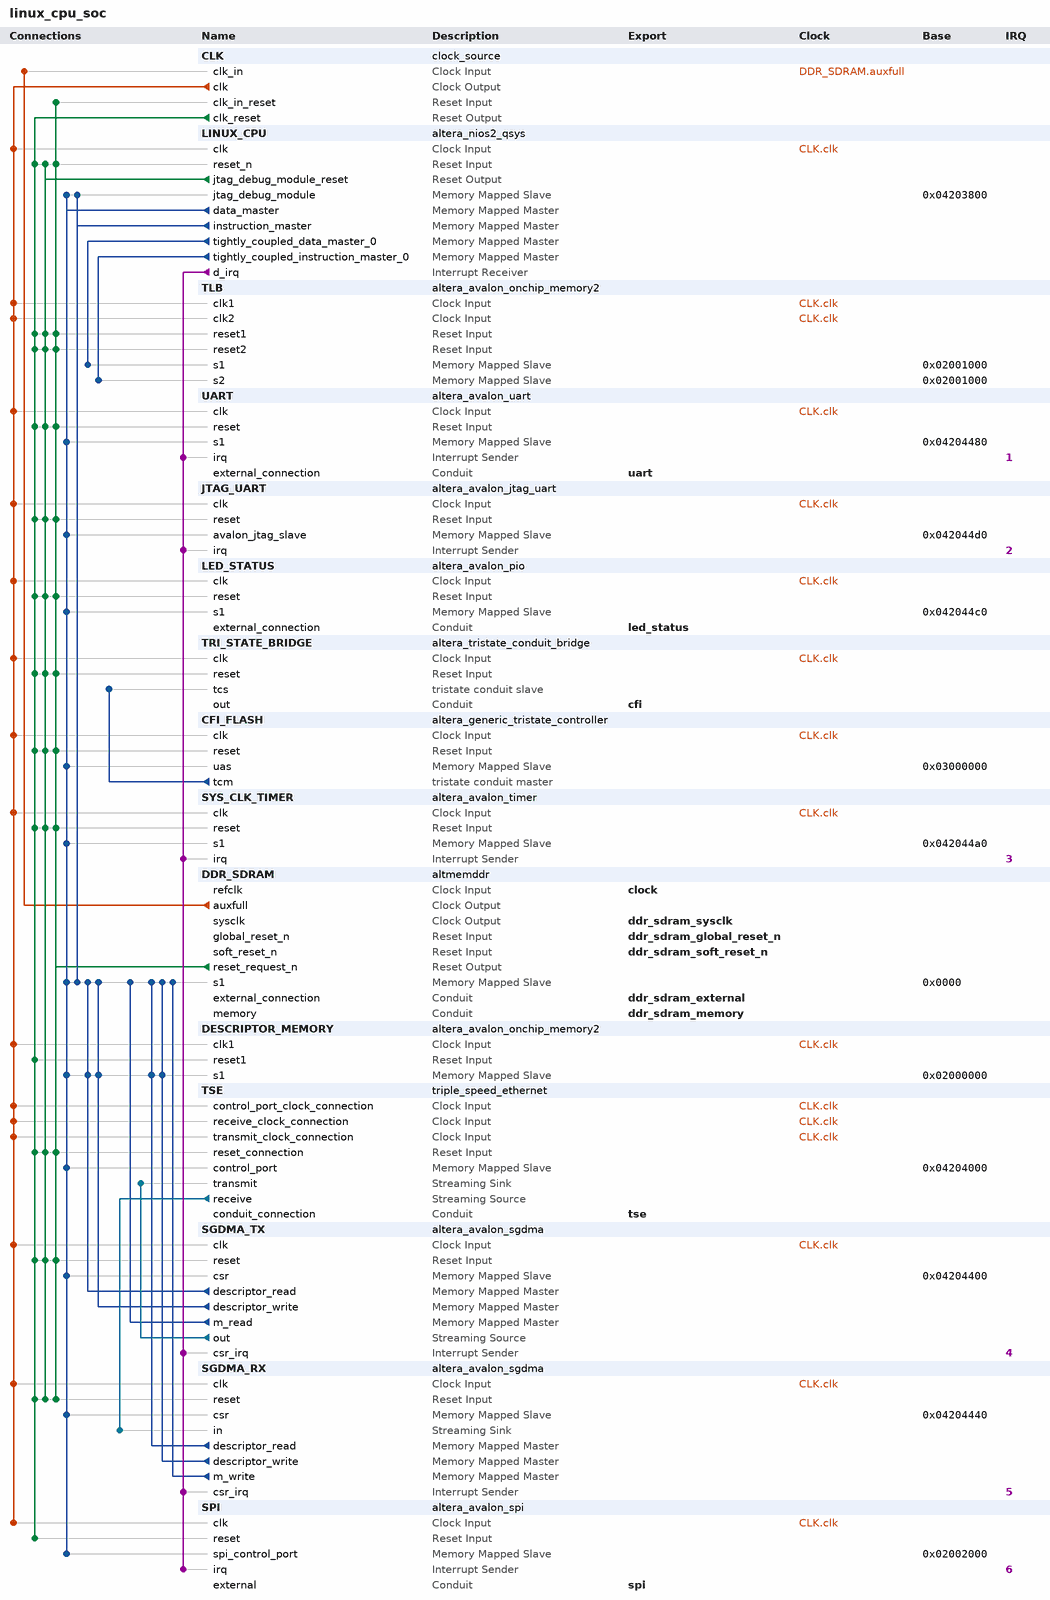
[diagram p0: system contents]
# Platform Designer (Qsys) system linux_cpu_soc, Cyclone III EP3C25F324C6
# Parameters at their usual value, and those the tool derives, are not listed.
package require -exact qsys 12.0
create_system linux_cpu_soc
set_project_property DEVICE_FAMILY {Cyclone III}
set_project_property DEVICE EP3C25F324C6

add_instance CLK clock_source 12.0
set_instance_parameter_value CLK clockFrequency 100000000

add_instance LINUX_CPU altera_nios2_qsys 12.0
set_instance_parameter_value LINUX_CPU mmu_enabled true
set_instance_parameter_value LINUX_CPU resetSlave DDR_SDRAM.s1
set_instance_parameter_value LINUX_CPU mmu_TLBMissExcSlave TLB.s2
set_instance_parameter_value LINUX_CPU exceptionSlave DDR_SDRAM.s1
set_instance_parameter_value LINUX_CPU breakSlave LINUX_CPU.jtag_debug_module
set_instance_parameter_value LINUX_CPU impl Fast
set_instance_parameter_value LINUX_CPU icache_size 4096
set_instance_parameter_value LINUX_CPU icache_numTCIM 1
set_instance_parameter_value LINUX_CPU dcache_numTCDM 1

add_instance TLB altera_avalon_onchip_memory2 12.0
set_instance_parameter_value TLB dataWidth 32
set_instance_parameter_value TLB dualPort true
set_instance_parameter_value TLB initMemContent true
set_instance_parameter_value TLB initializationFileName TLB
set_instance_parameter_value TLB memorySize 4096

add_instance UART altera_avalon_uart 12.0
set_instance_parameter_value UART baud 9600
set_instance_parameter_value UART dataBits 8
set_instance_parameter_value UART fixedBaud false
set_instance_parameter_value UART parity NONE
set_instance_parameter_value UART stopBits 1

add_instance JTAG_UART altera_avalon_jtag_uart 12.0
set_instance_parameter_value JTAG_UART simInteractiveOptions INTERACTIVE_ASCII_OUTPUT

add_instance LED_STATUS altera_avalon_pio 12.0
set_instance_parameter_value LED_STATUS direction Output
set_instance_parameter_value LED_STATUS resetValue 3
set_instance_parameter_value LED_STATUS width 2

add_instance TRI_STATE_BRIDGE altera_tristate_conduit_bridge 12.0

add_instance CFI_FLASH altera_generic_tristate_controller 12.0
set_instance_parameter_value CFI_FLASH TCM_ADDRESS_W 24
set_instance_parameter_value CFI_FLASH TCM_DATA_W 16
set_instance_parameter_value CFI_FLASH TCM_BYTEENABLE_W 2
set_instance_parameter_value CFI_FLASH TCM_READ_WAIT 100
set_instance_parameter_value CFI_FLASH TCM_WRITE_WAIT 100
set_instance_parameter_value CFI_FLASH TCM_SETUP_WAIT 25
set_instance_parameter_value CFI_FLASH TCM_DATA_HOLD 20
set_instance_parameter_value CFI_FLASH TCM_MAX_PENDING_READ_TRANSACTIONS 3
set_instance_parameter_value CFI_FLASH TCM_TURNAROUND_TIME 2
set_instance_parameter_value CFI_FLASH TCM_TIMING_UNITS 0
set_instance_parameter_value CFI_FLASH TCM_READLATENCY 2
set_instance_parameter_value CFI_FLASH TCM_SYMBOLS_PER_WORD 2
set_instance_parameter_value CFI_FLASH USE_READ 1
set_instance_parameter_value CFI_FLASH USE_BEGINTRANSFER 0
set_instance_parameter_value CFI_FLASH USE_BYTEENABLE 0
set_instance_parameter_value CFI_FLASH USE_OUTPUTENABLE 0
set_instance_parameter_value CFI_FLASH ACTIVE_LOW_READ 1
set_instance_parameter_value CFI_FLASH ACTIVE_LOW_BYTEENABLE 0
set_instance_parameter_value CFI_FLASH ACTIVE_LOW_OUTPUTENABLE 0
set_instance_parameter_value CFI_FLASH ACTIVE_LOW_BEGINTRANSFER 0
set_instance_parameter_value CFI_FLASH CHIPSELECT_THROUGH_READLATENCY 0
set_instance_parameter_value CFI_FLASH MODULE_ASSIGNMENT_KEYS embeddedsw.configuration.hwClassnameDriverSupportList,embeddedsw.configuration.hwClassnameDriverSupportDefault,embeddedsw.CMacro.SETUP_VALUE,embeddedsw.CMacro.WAIT_VALUE,embeddedsw.CMacro.HOLD_VALUE,embeddedsw.CMacro.TIMING_UNITS,embeddedsw.CMacro.SIZE,embeddedsw.memoryInfo.MEM_INIT_DATA_WIDTH,embeddedsw.memoryInfo.HAS_BYTE_LANE,embeddedsw.memoryInfo.IS_FLASH,embeddedsw.memoryInfo.GENERATE_DAT_SYM,embeddedsw.memoryInfo.GENERATE_FLASH,embeddedsw.memoryInfo.DAT_SYM_INSTALL_DIR,embeddedsw.memoryInfo.FLASH_INSTALL_DIR
set_instance_parameter_value CFI_FLASH MODULE_ASSIGNMENT_VALUES {altera_avalon_lan91c111:altera_avalon_cfi_flash,altera_avalon_cfi_flash,25,100,20,"ns",16777216u,16,1,1,1,1,SIM_DIR,APP_DIR}
set_instance_parameter_value CFI_FLASH INTERFACE_ASSIGNMENT_KEYS embeddedsw.configuration.isFlash,embeddedsw.configuration.isMemoryDevice,embeddedsw.configuration.isNonVolatileStorage
set_instance_parameter_value CFI_FLASH INTERFACE_ASSIGNMENT_VALUES 1,1,1

add_instance SYS_CLK_TIMER altera_avalon_timer 12.0
set_instance_parameter_value SYS_CLK_TIMER period 1
set_instance_parameter_value SYS_CLK_TIMER periodUnits MSEC
set_instance_parameter_value SYS_CLK_TIMER timerPreset FULL_FEATURED

add_instance DDR_SDRAM altmemddr 12.0
set_instance_parameter_value DDR_SDRAM pipeline_commands false
set_instance_parameter_value DDR_SDRAM debug_en false
set_instance_parameter_value DDR_SDRAM export_debug_port false
set_instance_parameter_value DDR_SDRAM use_generated_memory_model true
set_instance_parameter_value DDR_SDRAM dedicated_memory_clk_phase_label {Dedicated memory clock phase:}
set_instance_parameter_value DDR_SDRAM mem_if_clk_mhz 100.0
set_instance_parameter_value DDR_SDRAM quartus_project_exists false
set_instance_parameter_value DDR_SDRAM local_if_drate Full
set_instance_parameter_value DDR_SDRAM enable_v72_rsu false
set_instance_parameter_value DDR_SDRAM local_if_clk_mhz_label 100,0
set_instance_parameter_value DDR_SDRAM new_variant true
set_instance_parameter_value DDR_SDRAM mem_if_memtype {DDR SDRAM}
set_instance_parameter_value DDR_SDRAM pll_ref_clk_mhz 50.0
set_instance_parameter_value DDR_SDRAM mem_if_clk_ps_label {(10000 ps)}
set_instance_parameter_value DDR_SDRAM family {Cyclone III}
set_instance_parameter_value DDR_SDRAM project_family {Cyclone III}
set_instance_parameter_value DDR_SDRAM speed_grade 6
set_instance_parameter_value DDR_SDRAM dedicated_memory_clk_phase 0
set_instance_parameter_value DDR_SDRAM pll_ref_clk_ps_label {(20000 ps)}
set_instance_parameter_value DDR_SDRAM avalon_burst_length 1
set_instance_parameter_value DDR_SDRAM mem_if_clk_pair_count 1
set_instance_parameter_value DDR_SDRAM mem_if_cs_per_dimm 1
set_instance_parameter_value DDR_SDRAM pre_latency_label {Fix read latency at:}
set_instance_parameter_value DDR_SDRAM dedicated_memory_clk_en false
set_instance_parameter_value DDR_SDRAM mirror_addressing 0
set_instance_parameter_value DDR_SDRAM mem_if_bankaddr_width 2
set_instance_parameter_value DDR_SDRAM register_control_word_9 0000
set_instance_parameter_value DDR_SDRAM mem_if_rowaddr_width 13
set_instance_parameter_value DDR_SDRAM mem_dyn_deskew_en false
set_instance_parameter_value DDR_SDRAM post_latency_label {cycles (0 cycles=minimum latency, non-deterministic)}
set_instance_parameter_value DDR_SDRAM mem_if_dm_pins_en Yes
set_instance_parameter_value DDR_SDRAM local_if_dwidth_label 32
set_instance_parameter_value DDR_SDRAM register_control_word_7 0000
set_instance_parameter_value DDR_SDRAM register_control_word_8 0000
set_instance_parameter_value DDR_SDRAM mem_if_preset {Custom (PSC A2S56D40CTP-G5)}
set_instance_parameter_value DDR_SDRAM mem_if_pchaddr_bit 10
set_instance_parameter_value DDR_SDRAM WIDTH_RATIO 4
set_instance_parameter_value DDR_SDRAM vendor Other
set_instance_parameter_value DDR_SDRAM register_control_word_3 0000
set_instance_parameter_value DDR_SDRAM register_control_word_4 0000
set_instance_parameter_value DDR_SDRAM chip_or_dimm {Discrete Device}
set_instance_parameter_value DDR_SDRAM register_control_word_5 0000
set_instance_parameter_value DDR_SDRAM register_control_word_6 0000
set_instance_parameter_value DDR_SDRAM mem_fmax 200.0
set_instance_parameter_value DDR_SDRAM register_control_word_0 0000
set_instance_parameter_value DDR_SDRAM register_control_word_size 4
set_instance_parameter_value DDR_SDRAM register_control_word_1 0000
set_instance_parameter_value DDR_SDRAM register_control_word_2 0000
set_instance_parameter_value DDR_SDRAM register_control_word_11 0000
set_instance_parameter_value DDR_SDRAM register_control_word_10 0000
set_instance_parameter_value DDR_SDRAM mem_if_cs_width 1
set_instance_parameter_value DDR_SDRAM mem_if_preset_rlat 0
set_instance_parameter_value DDR_SDRAM mem_if_cs_per_rank 1
set_instance_parameter_value DDR_SDRAM fast_simulation_en FAST
set_instance_parameter_value DDR_SDRAM register_control_word_15 0000
set_instance_parameter_value DDR_SDRAM register_control_word_14 0000
set_instance_parameter_value DDR_SDRAM mem_if_dwidth 16
set_instance_parameter_value DDR_SDRAM mem_if_dq_per_dqs 8
set_instance_parameter_value DDR_SDRAM mem_if_coladdr_width 9
set_instance_parameter_value DDR_SDRAM register_control_word_13 0000
set_instance_parameter_value DDR_SDRAM register_control_word_12 0000
set_instance_parameter_value DDR_SDRAM mem_tiha_ps 600
set_instance_parameter_value DDR_SDRAM mem_tdsh_ck 0.2
set_instance_parameter_value DDR_SDRAM mem_if_trfc_ns 70.0
set_instance_parameter_value DDR_SDRAM mem_tqh_ck 0.36
set_instance_parameter_value DDR_SDRAM mem_tisa_ps 600
set_instance_parameter_value DDR_SDRAM mem_tdss_ck 0.2
set_instance_parameter_value DDR_SDRAM mem_trtp_ns 0.0
set_instance_parameter_value DDR_SDRAM mem_if_tinit_us 200.0
set_instance_parameter_value DDR_SDRAM mem_if_trcd_ns 15.0
set_instance_parameter_value DDR_SDRAM mem_if_twtr_ck 2
set_instance_parameter_value DDR_SDRAM mem_trrd_ns 11.0
set_instance_parameter_value DDR_SDRAM mem_tdqss_ck 0.28
set_instance_parameter_value DDR_SDRAM mem_tqhs_ps 500
set_instance_parameter_value DDR_SDRAM mem_tdsa_ps 400
set_instance_parameter_value DDR_SDRAM mem_tac_ps 700
set_instance_parameter_value DDR_SDRAM mem_tdha_ps 400
set_instance_parameter_value DDR_SDRAM mem_if_tras_ns 40.0
set_instance_parameter_value DDR_SDRAM mem_if_twr_ns 15.0
set_instance_parameter_value DDR_SDRAM mem_tdqsck_ps 550
set_instance_parameter_value DDR_SDRAM mem_if_trp_ns 15.0
set_instance_parameter_value DDR_SDRAM mem_tdqsq_ps 400
set_instance_parameter_value DDR_SDRAM mem_if_tmrd_ns 10.0
set_instance_parameter_value DDR_SDRAM mem_tfaw_ns 0.0
set_instance_parameter_value DDR_SDRAM mem_if_trefi_us 7.0
set_instance_parameter_value DDR_SDRAM mem_tcl_40_fmax 533.0
set_instance_parameter_value DDR_SDRAM mem_odt Disabled
set_instance_parameter_value DDR_SDRAM mp_WLH_percent 0.6
set_instance_parameter_value DDR_SDRAM mem_drv_str Normal
set_instance_parameter_value DDR_SDRAM mp_DH_percent 0.5
set_instance_parameter_value DDR_SDRAM input_period 0
set_instance_parameter_value DDR_SDRAM mp_QH_percent 0.5
set_instance_parameter_value DDR_SDRAM mp_QHS_percent 0.5
set_instance_parameter_value DDR_SDRAM mem_tcl_30_fmax 200.0
set_instance_parameter_value DDR_SDRAM ac_clk_select 90
set_instance_parameter_value DDR_SDRAM mp_DQSQ_percent 0.65
set_instance_parameter_value DDR_SDRAM mp_DS_percent 0.6
set_instance_parameter_value DDR_SDRAM pll_reconfig_ports_en false
set_instance_parameter_value DDR_SDRAM mem_btype Sequential
set_instance_parameter_value DDR_SDRAM mp_IS_percent 0.7
set_instance_parameter_value DDR_SDRAM mem_tcl 3.0
set_instance_parameter_value DDR_SDRAM mp_DQSS_percent 0.5
set_instance_parameter_value DDR_SDRAM export_bank_info false
set_instance_parameter_value DDR_SDRAM mp_DSS_percent 0.6
set_instance_parameter_value DDR_SDRAM mem_dll_en Yes
set_instance_parameter_value DDR_SDRAM ac_phase 90
set_instance_parameter_value DDR_SDRAM mem_if_oct_en false
set_instance_parameter_value DDR_SDRAM mem_tcl_60_fmax 533.0
set_instance_parameter_value DDR_SDRAM mp_DSH_percent 0.6
set_instance_parameter_value DDR_SDRAM mem_if_dqsn_en false
set_instance_parameter_value DDR_SDRAM enable_mp_calibration true
set_instance_parameter_value DDR_SDRAM mp_IH_percent 0.6
set_instance_parameter_value DDR_SDRAM mem_tcl_15_fmax 533.0
set_instance_parameter_value DDR_SDRAM dll_external false
set_instance_parameter_value DDR_SDRAM mem_bl 4
set_instance_parameter_value DDR_SDRAM mp_WLS_percent 0.7
set_instance_parameter_value DDR_SDRAM mem_tcl_50_fmax 533.0
set_instance_parameter_value DDR_SDRAM mp_DQSCK_percent 0.5
set_instance_parameter_value DDR_SDRAM mem_tcl_25_fmax 200.0
set_instance_parameter_value DDR_SDRAM mem_tcl_20_fmax 133.333
set_instance_parameter_value DDR_SDRAM cfg_reorder_data true
set_instance_parameter_value DDR_SDRAM ctl_ecc_en false
set_instance_parameter_value DDR_SDRAM ctl_hrb_en false
set_instance_parameter_value DDR_SDRAM ref_clk_source CLK
set_instance_parameter_value DDR_SDRAM cfg_data_reordering_type INTER_BANK
set_instance_parameter_value DDR_SDRAM ctl_powerdn_en false
set_instance_parameter_value DDR_SDRAM multicast_wr_en false
set_instance_parameter_value DDR_SDRAM auto_powerdn_cycles 0
set_instance_parameter_value DDR_SDRAM ctl_self_refresh_en false
set_instance_parameter_value DDR_SDRAM cfg_starve_limit 10
set_instance_parameter_value DDR_SDRAM ctl_latency 0
set_instance_parameter_value DDR_SDRAM tool_context SOPC_BUILDER
set_instance_parameter_value DDR_SDRAM mem_addr_mapping CHIP_ROW_BANK_COL
set_instance_parameter_value DDR_SDRAM burst_merge_en false
set_instance_parameter_value DDR_SDRAM user_refresh_en false
set_instance_parameter_value DDR_SDRAM qsys_mode true
set_instance_parameter_value DDR_SDRAM clk_source_sharing_en false
set_instance_parameter_value DDR_SDRAM ctl_lookahead_depth 4
set_instance_parameter_value DDR_SDRAM ctl_autopch_en false
set_instance_parameter_value DDR_SDRAM ctl_dynamic_bank_allocation false
set_instance_parameter_value DDR_SDRAM ctl_dynamic_bank_num 4
set_instance_parameter_value DDR_SDRAM local_if_type_avalon true
set_instance_parameter_value DDR_SDRAM csr_en false
set_instance_parameter_value DDR_SDRAM ctl_auto_correct_en false
set_instance_parameter_value DDR_SDRAM auto_powerdn_en false
set_instance_parameter_value DDR_SDRAM phy_if_type_afi true
set_instance_parameter_value DDR_SDRAM controller_type ngv110_ctl
set_instance_parameter_value DDR_SDRAM max_local_size 4
set_instance_parameter_value DDR_SDRAM mem_srtr Normal
set_instance_parameter_value DDR_SDRAM mem_mpr_loc {Predefined Pattern}
set_instance_parameter_value DDR_SDRAM dss_tinit_rst_us 200.0
set_instance_parameter_value DDR_SDRAM mem_tcl_90_fmax 400.0
set_instance_parameter_value DDR_SDRAM mem_rtt_wr {Dynamic ODT off}
set_instance_parameter_value DDR_SDRAM mem_tcl_100_fmax 400.0
set_instance_parameter_value DDR_SDRAM mem_pasr {Full Array}
set_instance_parameter_value DDR_SDRAM mem_asrm {Manual SR Reference (SRT)}
set_instance_parameter_value DDR_SDRAM mem_mpr_oper {Predefined Pattern}
set_instance_parameter_value DDR_SDRAM mem_tcl_80_fmax 400.0
set_instance_parameter_value DDR_SDRAM mem_drv_impedance RZQ/7
set_instance_parameter_value DDR_SDRAM mem_rtt_nom {ODT Disabled}
set_instance_parameter_value DDR_SDRAM mem_tcl_70_fmax 400.0
set_instance_parameter_value DDR_SDRAM mem_wtcl 5.0
set_instance_parameter_value DDR_SDRAM mem_dll_pch {Fast Exit}
set_instance_parameter_value DDR_SDRAM mem_atcl Disabled
set_instance_parameter_value DDR_SDRAM board_settings_valid true
set_instance_parameter_value DDR_SDRAM t_IH 0.6
set_instance_parameter_value DDR_SDRAM board_intra_DQS_group_skew 0.02
set_instance_parameter_value DDR_SDRAM isi_DQS 0.0
set_instance_parameter_value DDR_SDRAM addr_cmd_slew_rate 1.0
set_instance_parameter_value DDR_SDRAM board_tpd_inter_DIMM 0.05
set_instance_parameter_value DDR_SDRAM board_addresscmd_CK_skew 0.0
set_instance_parameter_value DDR_SDRAM t_DS_calculated 0,400
set_instance_parameter_value DDR_SDRAM isi_addresscmd_hold 0.0
set_instance_parameter_value DDR_SDRAM t_IS 0.6
set_instance_parameter_value DDR_SDRAM restore_default_toggle false
set_instance_parameter_value DDR_SDRAM dqs_dqsn_slew_rate 2.0
set_instance_parameter_value DDR_SDRAM dq_slew_rate 1.0
set_instance_parameter_value DDR_SDRAM board_inter_DQS_group_skew 0.02
set_instance_parameter_value DDR_SDRAM isi_addresscmd_setup 0.0
set_instance_parameter_value DDR_SDRAM board_minCK_DQS_skew -0.01
set_instance_parameter_value DDR_SDRAM t_IS_calculated 0,600
set_instance_parameter_value DDR_SDRAM num_slots_or_devices 1
set_instance_parameter_value DDR_SDRAM board_maxCK_DQS_skew 0.01
set_instance_parameter_value DDR_SDRAM board_skew_ps 20
set_instance_parameter_value DDR_SDRAM t_DH 0.4
set_instance_parameter_value DDR_SDRAM ck_ckn_slew_rate 2.0
set_instance_parameter_value DDR_SDRAM isi_DQ 0.0
set_instance_parameter_value DDR_SDRAM t_IH_calculated 0,600
set_instance_parameter_value DDR_SDRAM t_DH_calculated 0,400
set_instance_parameter_value DDR_SDRAM t_DS 0.4

add_instance DESCRIPTOR_MEMORY altera_avalon_onchip_memory2 12.0
set_instance_parameter_value DESCRIPTOR_MEMORY dataWidth 32
set_instance_parameter_value DESCRIPTOR_MEMORY dualPort false
set_instance_parameter_value DESCRIPTOR_MEMORY initMemContent true
set_instance_parameter_value DESCRIPTOR_MEMORY initializationFileName DESCRIPTOR_MEMORY
set_instance_parameter_value DESCRIPTOR_MEMORY memorySize 4096

add_instance TSE triple_speed_ethernet 12.0
set_instance_parameter_value TSE atlanticSinkClockRate 0
set_instance_parameter_value TSE atlanticSinkClockSource unassigned
set_instance_parameter_value TSE atlanticSourceClockRate 0
set_instance_parameter_value TSE atlanticSourceClockSource unassigned
set_instance_parameter_value TSE avalonSlaveClockRate 0
set_instance_parameter_value TSE avalonSlaveClockSource unassigned
set_instance_parameter_value TSE avalonStNeighbours {unassigned=unassigned}
set_instance_parameter_value TSE channel_count 1
set_instance_parameter_value TSE core_variation SMALL_MAC_10_100
set_instance_parameter_value TSE core_version 3072
set_instance_parameter_value TSE crc32check16bit 0
set_instance_parameter_value TSE crc32dwidth 8
set_instance_parameter_value TSE crc32gendelay 6
set_instance_parameter_value TSE crc32s1l2_extern false
set_instance_parameter_value TSE cust_version 0
set_instance_parameter_value TSE dataBitsPerSymbol 8
set_instance_parameter_value TSE dev_version 3072
set_instance_parameter_value TSE eg_addr 11
set_instance_parameter_value TSE ena_hash false
set_instance_parameter_value TSE enable_alt_reconfig false
set_instance_parameter_value TSE enable_clk_sharing false
set_instance_parameter_value TSE enable_ena 32
set_instance_parameter_value TSE enable_fifoless false
set_instance_parameter_value TSE enable_gmii_loopback false
set_instance_parameter_value TSE enable_hd_logic false
set_instance_parameter_value TSE enable_mac_flow_ctrl false
set_instance_parameter_value TSE enable_mac_txaddr_set true
set_instance_parameter_value TSE enable_mac_vlan false
set_instance_parameter_value TSE enable_maclite true
set_instance_parameter_value TSE enable_magic_detect false
set_instance_parameter_value TSE enable_multi_channel false
set_instance_parameter_value TSE enable_pkt_class true
set_instance_parameter_value TSE enable_pma false
set_instance_parameter_value TSE enable_ptp_1step false
set_instance_parameter_value TSE enable_reg_sharing false
set_instance_parameter_value TSE enable_sgmii false
set_instance_parameter_value TSE enable_shift16 true
set_instance_parameter_value TSE enable_sup_addr false
set_instance_parameter_value TSE enable_timestamping false
set_instance_parameter_value TSE enable_use_internal_fifo true
set_instance_parameter_value TSE export_calblkclk false
set_instance_parameter_value TSE export_pwrdn false
set_instance_parameter_value TSE ext_stat_cnt_ena false
set_instance_parameter_value TSE gigeAdvanceMode true
set_instance_parameter_value TSE ifGMII MII
set_instance_parameter_value TSE ifPCSuseEmbeddedSerdes false
set_instance_parameter_value TSE ing_addr 11
set_instance_parameter_value TSE insert_ta true
set_instance_parameter_value TSE maclite_gige false
set_instance_parameter_value TSE max_channels 1
set_instance_parameter_value TSE mdio_clk_div 40
set_instance_parameter_value TSE phy_identifier 0
set_instance_parameter_value TSE ramType AUTO
set_instance_parameter_value TSE reset_level 1
set_instance_parameter_value TSE starting_channel_number 0
set_instance_parameter_value TSE stat_cnt_ena false
set_instance_parameter_value TSE timingAdapterName timingAdapter
set_instance_parameter_value TSE toolContext SOPC_BUILDER
set_instance_parameter_value TSE transceiver_type GXB
set_instance_parameter_value TSE tstamp_fp_width 4
set_instance_parameter_value TSE uiHostClockFrequency 0
set_instance_parameter_value TSE uiMDIOFreq {0.0 MHz}
set_instance_parameter_value TSE useLvds false
set_instance_parameter_value TSE useMAC true
set_instance_parameter_value TSE useMDIO true
set_instance_parameter_value TSE usePCS false
set_instance_parameter_value TSE use_sync_reset true

add_instance SGDMA_TX altera_avalon_sgdma 12.0
set_instance_parameter_value SGDMA_TX enableBurstTransfers false
set_instance_parameter_value SGDMA_TX enableUnalignedTransfers false
set_instance_parameter_value SGDMA_TX readBlockDataWidth 32
set_instance_parameter_value SGDMA_TX sinkErrorWidth 0
set_instance_parameter_value SGDMA_TX sourceErrorWidth 1
set_instance_parameter_value SGDMA_TX transferMode MEMORY_TO_STREAM
set_instance_parameter_value SGDMA_TX writeBurstcountWidth 4

add_instance SGDMA_RX altera_avalon_sgdma 12.0
set_instance_parameter_value SGDMA_RX enableBurstTransfers false
set_instance_parameter_value SGDMA_RX enableUnalignedTransfers false
set_instance_parameter_value SGDMA_RX readBlockDataWidth 32
set_instance_parameter_value SGDMA_RX sinkErrorWidth 6
set_instance_parameter_value SGDMA_RX sourceErrorWidth 0
set_instance_parameter_value SGDMA_RX transferMode STREAM_TO_MEMORY
set_instance_parameter_value SGDMA_RX writeBurstcountWidth 4

add_instance SPI altera_avalon_spi 12.0
set_instance_parameter_value SPI clockPolarity 0
set_instance_parameter_value SPI dataWidth 8
set_instance_parameter_value SPI masterSPI true
set_instance_parameter_value SPI numberOfSlaves 1
set_instance_parameter_value SPI targetClockRate 1000000

# connections
add_connection CLK.clk CFI_FLASH.clk clock
add_connection CLK.clk DESCRIPTOR_MEMORY.clk1 clock
add_connection CLK.clk JTAG_UART.clk clock
add_connection CLK.clk LED_STATUS.clk clock
add_connection CLK.clk LINUX_CPU.clk clock
add_connection CLK.clk SGDMA_RX.clk clock
add_connection CLK.clk SGDMA_TX.clk clock
add_connection CLK.clk SPI.clk clock
add_connection CLK.clk SYS_CLK_TIMER.clk clock
add_connection CLK.clk TLB.clk1 clock
add_connection CLK.clk TLB.clk2 clock
add_connection CLK.clk TRI_STATE_BRIDGE.clk clock
add_connection CLK.clk TSE.control_port_clock_connection clock
add_connection CLK.clk TSE.receive_clock_connection clock
add_connection CLK.clk TSE.transmit_clock_connection clock
add_connection CLK.clk UART.clk clock
add_connection DDR_SDRAM.auxfull CLK.clk_in clock
add_connection CLK.clk_reset CFI_FLASH.reset reset
add_connection CLK.clk_reset DESCRIPTOR_MEMORY.reset1 reset
add_connection CLK.clk_reset JTAG_UART.reset reset
add_connection CLK.clk_reset LED_STATUS.reset reset
add_connection CLK.clk_reset LINUX_CPU.reset_n reset
add_connection CLK.clk_reset SGDMA_RX.reset reset
add_connection CLK.clk_reset SGDMA_TX.reset reset
add_connection CLK.clk_reset SPI.reset reset
add_connection CLK.clk_reset SYS_CLK_TIMER.reset reset
add_connection CLK.clk_reset TLB.reset1 reset
add_connection CLK.clk_reset TLB.reset2 reset
add_connection CLK.clk_reset TRI_STATE_BRIDGE.reset reset
add_connection CLK.clk_reset TSE.reset_connection reset
add_connection CLK.clk_reset UART.reset reset
add_connection DDR_SDRAM.reset_request_n CFI_FLASH.reset reset
add_connection DDR_SDRAM.reset_request_n CLK.clk_in_reset reset
add_connection DDR_SDRAM.reset_request_n JTAG_UART.reset reset
add_connection DDR_SDRAM.reset_request_n LED_STATUS.reset reset
add_connection DDR_SDRAM.reset_request_n LINUX_CPU.reset_n reset
add_connection DDR_SDRAM.reset_request_n SGDMA_RX.reset reset
add_connection DDR_SDRAM.reset_request_n SGDMA_TX.reset reset
add_connection DDR_SDRAM.reset_request_n SYS_CLK_TIMER.reset reset
add_connection DDR_SDRAM.reset_request_n TLB.reset1 reset
add_connection DDR_SDRAM.reset_request_n TLB.reset2 reset
add_connection DDR_SDRAM.reset_request_n TRI_STATE_BRIDGE.reset reset
add_connection DDR_SDRAM.reset_request_n TSE.reset_connection reset
add_connection DDR_SDRAM.reset_request_n UART.reset reset
add_connection LINUX_CPU.jtag_debug_module_reset CFI_FLASH.reset reset
add_connection LINUX_CPU.jtag_debug_module_reset JTAG_UART.reset reset
add_connection LINUX_CPU.jtag_debug_module_reset LED_STATUS.reset reset
add_connection LINUX_CPU.jtag_debug_module_reset LINUX_CPU.reset_n reset
add_connection LINUX_CPU.jtag_debug_module_reset SGDMA_RX.reset reset
add_connection LINUX_CPU.jtag_debug_module_reset SGDMA_TX.reset reset
add_connection LINUX_CPU.jtag_debug_module_reset SYS_CLK_TIMER.reset reset
add_connection LINUX_CPU.jtag_debug_module_reset TLB.reset1 reset
add_connection LINUX_CPU.jtag_debug_module_reset TLB.reset2 reset
add_connection LINUX_CPU.jtag_debug_module_reset TRI_STATE_BRIDGE.reset reset
add_connection LINUX_CPU.jtag_debug_module_reset TSE.reset_connection reset
add_connection LINUX_CPU.jtag_debug_module_reset UART.reset reset
add_connection LINUX_CPU.data_master CFI_FLASH.uas avalon
set_connection_parameter_value LINUX_CPU.data_master/CFI_FLASH.uas baseAddress 0x03000000
add_connection LINUX_CPU.data_master DDR_SDRAM.s1 avalon
set_connection_parameter_value LINUX_CPU.data_master/DDR_SDRAM.s1 baseAddress 0x0000
add_connection LINUX_CPU.data_master DESCRIPTOR_MEMORY.s1 avalon
set_connection_parameter_value LINUX_CPU.data_master/DESCRIPTOR_MEMORY.s1 baseAddress 0x02000000
add_connection LINUX_CPU.data_master JTAG_UART.avalon_jtag_slave avalon
set_connection_parameter_value LINUX_CPU.data_master/JTAG_UART.avalon_jtag_slave baseAddress 0x042044d0
add_connection LINUX_CPU.data_master LED_STATUS.s1 avalon
set_connection_parameter_value LINUX_CPU.data_master/LED_STATUS.s1 baseAddress 0x042044c0
add_connection LINUX_CPU.data_master LINUX_CPU.jtag_debug_module avalon
set_connection_parameter_value LINUX_CPU.data_master/LINUX_CPU.jtag_debug_module baseAddress 0x04203800
add_connection LINUX_CPU.data_master SGDMA_RX.csr avalon
set_connection_parameter_value LINUX_CPU.data_master/SGDMA_RX.csr baseAddress 0x04204440
add_connection LINUX_CPU.data_master SGDMA_TX.csr avalon
set_connection_parameter_value LINUX_CPU.data_master/SGDMA_TX.csr baseAddress 0x04204400
add_connection LINUX_CPU.data_master SPI.spi_control_port avalon
set_connection_parameter_value LINUX_CPU.data_master/SPI.spi_control_port baseAddress 0x02002000
add_connection LINUX_CPU.data_master SYS_CLK_TIMER.s1 avalon
set_connection_parameter_value LINUX_CPU.data_master/SYS_CLK_TIMER.s1 baseAddress 0x042044a0
add_connection LINUX_CPU.data_master TSE.control_port avalon
set_connection_parameter_value LINUX_CPU.data_master/TSE.control_port baseAddress 0x04204000
add_connection LINUX_CPU.data_master UART.s1 avalon
set_connection_parameter_value LINUX_CPU.data_master/UART.s1 baseAddress 0x04204480
add_connection LINUX_CPU.instruction_master DDR_SDRAM.s1 avalon
set_connection_parameter_value LINUX_CPU.instruction_master/DDR_SDRAM.s1 baseAddress 0x0000
add_connection LINUX_CPU.instruction_master LINUX_CPU.jtag_debug_module avalon
set_connection_parameter_value LINUX_CPU.instruction_master/LINUX_CPU.jtag_debug_module baseAddress 0x04203800
add_connection LINUX_CPU.tightly_coupled_data_master_0 TLB.s1 avalon
set_connection_parameter_value LINUX_CPU.tightly_coupled_data_master_0/TLB.s1 baseAddress 0x02001000
add_connection LINUX_CPU.tightly_coupled_instruction_master_0 TLB.s2 avalon
set_connection_parameter_value LINUX_CPU.tightly_coupled_instruction_master_0/TLB.s2 baseAddress 0x02001000
add_connection SGDMA_RX.descriptor_read DDR_SDRAM.s1 avalon
set_connection_parameter_value SGDMA_RX.descriptor_read/DDR_SDRAM.s1 baseAddress 0x0000
add_connection SGDMA_RX.descriptor_read DESCRIPTOR_MEMORY.s1 avalon
set_connection_parameter_value SGDMA_RX.descriptor_read/DESCRIPTOR_MEMORY.s1 baseAddress 0x02000000
add_connection SGDMA_RX.descriptor_write DDR_SDRAM.s1 avalon
set_connection_parameter_value SGDMA_RX.descriptor_write/DDR_SDRAM.s1 baseAddress 0x0000
add_connection SGDMA_RX.descriptor_write DESCRIPTOR_MEMORY.s1 avalon
set_connection_parameter_value SGDMA_RX.descriptor_write/DESCRIPTOR_MEMORY.s1 baseAddress 0x02000000
add_connection SGDMA_RX.m_write DDR_SDRAM.s1 avalon
set_connection_parameter_value SGDMA_RX.m_write/DDR_SDRAM.s1 baseAddress 0x0000
add_connection SGDMA_TX.descriptor_read DDR_SDRAM.s1 avalon
set_connection_parameter_value SGDMA_TX.descriptor_read/DDR_SDRAM.s1 baseAddress 0x0000
add_connection SGDMA_TX.descriptor_read DESCRIPTOR_MEMORY.s1 avalon
set_connection_parameter_value SGDMA_TX.descriptor_read/DESCRIPTOR_MEMORY.s1 baseAddress 0x02000000
add_connection SGDMA_TX.descriptor_write DDR_SDRAM.s1 avalon
set_connection_parameter_value SGDMA_TX.descriptor_write/DDR_SDRAM.s1 baseAddress 0x0000
add_connection SGDMA_TX.descriptor_write DESCRIPTOR_MEMORY.s1 avalon
set_connection_parameter_value SGDMA_TX.descriptor_write/DESCRIPTOR_MEMORY.s1 baseAddress 0x02000000
add_connection SGDMA_TX.m_read DDR_SDRAM.s1 avalon
set_connection_parameter_value SGDMA_TX.m_read/DDR_SDRAM.s1 baseAddress 0x0000
add_connection SGDMA_TX.out TSE.transmit avalon_streaming
add_connection TSE.receive SGDMA_RX.in avalon_streaming
add_connection LINUX_CPU.d_irq JTAG_UART.irq interrupt
set_connection_parameter_value LINUX_CPU.d_irq/JTAG_UART.irq irqNumber 2
add_connection LINUX_CPU.d_irq SGDMA_RX.csr_irq interrupt
set_connection_parameter_value LINUX_CPU.d_irq/SGDMA_RX.csr_irq irqNumber 5
add_connection LINUX_CPU.d_irq SGDMA_TX.csr_irq interrupt
set_connection_parameter_value LINUX_CPU.d_irq/SGDMA_TX.csr_irq irqNumber 4
add_connection LINUX_CPU.d_irq SPI.irq interrupt
set_connection_parameter_value LINUX_CPU.d_irq/SPI.irq irqNumber 6
add_connection LINUX_CPU.d_irq SYS_CLK_TIMER.irq interrupt
set_connection_parameter_value LINUX_CPU.d_irq/SYS_CLK_TIMER.irq irqNumber 3
add_connection LINUX_CPU.d_irq UART.irq interrupt
set_connection_parameter_value LINUX_CPU.d_irq/UART.irq irqNumber 1
add_connection CFI_FLASH.tcm TRI_STATE_BRIDGE.tcs tristate_conduit

# exported interfaces
add_interface ddr_sdram_external conduit end
set_interface_property ddr_sdram_external EXPORT_OF DDR_SDRAM.external_connection
add_interface ddr_sdram_memory conduit end
set_interface_property ddr_sdram_memory EXPORT_OF DDR_SDRAM.memory
add_interface uart conduit end
set_interface_property uart EXPORT_OF UART.external_connection
add_interface led_status conduit end
set_interface_property led_status EXPORT_OF LED_STATUS.external_connection
add_interface tse conduit end
set_interface_property tse EXPORT_OF TSE.conduit_connection
add_interface cfi conduit end
set_interface_property cfi EXPORT_OF TRI_STATE_BRIDGE.out
add_interface clock clock sink
set_interface_property clock EXPORT_OF DDR_SDRAM.refclk
add_interface ddr_sdram_global_reset_n reset sink
set_interface_property ddr_sdram_global_reset_n EXPORT_OF DDR_SDRAM.global_reset_n
add_interface ddr_sdram_soft_reset_n reset sink
set_interface_property ddr_sdram_soft_reset_n EXPORT_OF DDR_SDRAM.soft_reset_n
add_interface ddr_sdram_sysclk clock source
set_interface_property ddr_sdram_sysclk EXPORT_OF DDR_SDRAM.sysclk
add_interface spi conduit end
set_interface_property spi EXPORT_OF SPI.external

save_system linux_cpu_soc.qsys
